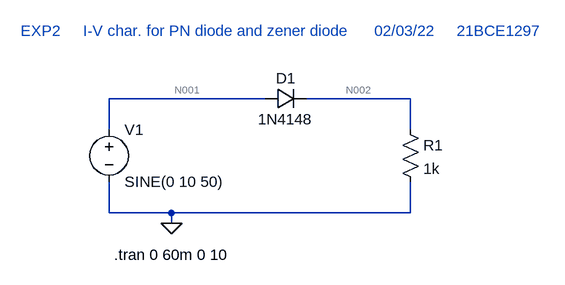
[diagram p0: schematic Exp2.asc]
Exp2.asc, the LTspice schematic file:
Version 4
SHEET 1 968 680
WIRE 368 144 128 144
WIRE 592 144 432 144
WIRE 128 192 128 144
WIRE 592 192 592 144
WIRE 128 320 128 272
WIRE 224 320 128 320
WIRE 592 320 592 272
WIRE 592 320 224 320
WIRE 224 336 224 320
FLAG 224 336 0
SYMBOL voltage 128 176 R0
WINDOW 123 0 0 Left 0
WINDOW 39 0 0 Left 0
SYMATTR InstName V1
SYMATTR Value SINE(0 10 50)
SYMBOL diode 368 160 R270
WINDOW 0 32 32 VTop 2
WINDOW 3 0 32 VBottom 2
SYMATTR InstName D1
SYMATTR Value 1N4148
SYMBOL res 576 176 R0
SYMATTR InstName R1
SYMATTR Value 1k
TEXT -8 40 Left 2 ;EXP2     I-V char. for PN diode and zener diode      02/03/22     21BCE1297
TEXT 136 384 Left 2 !.tran 0 60m 0 10

The netlist it stands for:
* Exp2.asc
V1 N001 0 SINE(0 10 50)
D1 N001 N002 1N4148
R1 N002 0 1k
.model D D
.lib standard.dio
* EXP2     I-V char. for PN diode and zener diode      02/03/22     21BCE1297
.tran 0 60m 0 10
.backanno
.end

* Results of the author's LTspice run, read from the files saved beside the schematic
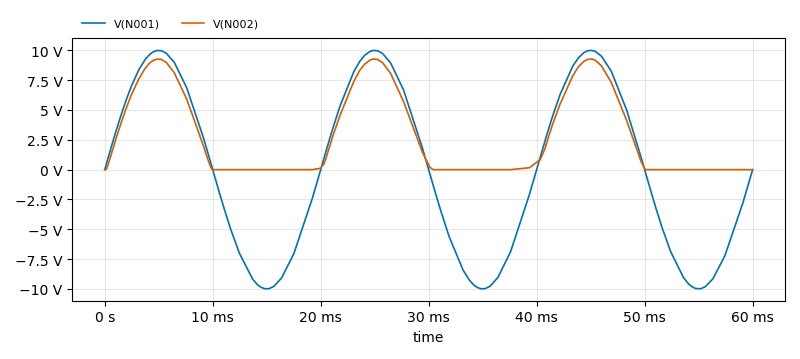
[diagram p1: Transient Analysis of Exp2.asc, plotted from the saved traces]
* Transient Analysis, 1 run:
*   V(N001): min -9.987 V, max 9.997 V, average 3.559 mV, rms 7.092 V, last 0 V
*   V(N002): min -13.31 µV, max 9.275 V, average 2.819 V, rms 4.523 V, last 7.821 µV